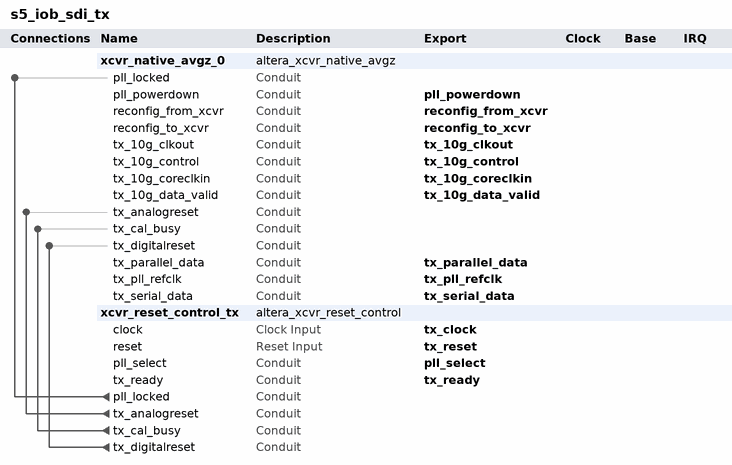
[diagram p0: system contents]
# Platform Designer (Qsys) system s5_iob_sdi_tx, Arria V GZ 5AGZME3H2F35C3
# Parameters at their usual value, and those the tool derives, are not listed.
package require -exact qsys 17.0
create_system s5_iob_sdi_tx
set_project_property DEVICE_FAMILY {Arria V GZ}
set_project_property DEVICE 5AGZME3H2F35C3

add_instance xcvr_native_avgz_0 altera_xcvr_native_avgz 17.0
set_instance_parameter_value xcvr_native_avgz_0 bonded_mode non_bonded
set_instance_parameter_value xcvr_native_avgz_0 cdr_reconfig_enable 0
set_instance_parameter_value xcvr_native_avgz_0 cdr_refclk_cnt 1
set_instance_parameter_value xcvr_native_avgz_0 cdr_refclk_select 0
set_instance_parameter_value xcvr_native_avgz_0 channels 1
set_instance_parameter_value xcvr_native_avgz_0 device_family {Arria V GZ}
set_instance_parameter_value xcvr_native_avgz_0 device_speedgrade fastest
set_instance_parameter_value xcvr_native_avgz_0 enable_port_rx_10g_bitslip 0
set_instance_parameter_value xcvr_native_avgz_0 enable_port_rx_10g_blk_lock 0
set_instance_parameter_value xcvr_native_avgz_0 enable_port_rx_10g_blk_sh_err 0
set_instance_parameter_value xcvr_native_avgz_0 enable_port_rx_10g_clk33out 0
set_instance_parameter_value xcvr_native_avgz_0 enable_port_rx_10g_clr_errblk_count 0
set_instance_parameter_value xcvr_native_avgz_0 enable_port_rx_10g_crc32_err 0
set_instance_parameter_value xcvr_native_avgz_0 enable_port_rx_10g_data_valid 0
set_instance_parameter_value xcvr_native_avgz_0 enable_port_rx_10g_descram_err 0
set_instance_parameter_value xcvr_native_avgz_0 enable_port_rx_10g_fifo_align_clr 0
set_instance_parameter_value xcvr_native_avgz_0 enable_port_rx_10g_fifo_align_en 0
set_instance_parameter_value xcvr_native_avgz_0 enable_port_rx_10g_fifo_align_val 0
set_instance_parameter_value xcvr_native_avgz_0 enable_port_rx_10g_fifo_del 0
set_instance_parameter_value xcvr_native_avgz_0 enable_port_rx_10g_fifo_empty 0
set_instance_parameter_value xcvr_native_avgz_0 enable_port_rx_10g_fifo_full 0
set_instance_parameter_value xcvr_native_avgz_0 enable_port_rx_10g_fifo_insert 0
set_instance_parameter_value xcvr_native_avgz_0 enable_port_rx_10g_fifo_pempty 0
set_instance_parameter_value xcvr_native_avgz_0 enable_port_rx_10g_fifo_pfull 0
set_instance_parameter_value xcvr_native_avgz_0 enable_port_rx_10g_fifo_rd_en 0
set_instance_parameter_value xcvr_native_avgz_0 enable_port_rx_10g_frame 0
set_instance_parameter_value xcvr_native_avgz_0 enable_port_rx_10g_frame_diag_err 0
set_instance_parameter_value xcvr_native_avgz_0 enable_port_rx_10g_frame_diag_status 0
set_instance_parameter_value xcvr_native_avgz_0 enable_port_rx_10g_frame_lock 0
set_instance_parameter_value xcvr_native_avgz_0 enable_port_rx_10g_frame_mfrm_err 0
set_instance_parameter_value xcvr_native_avgz_0 enable_port_rx_10g_frame_pyld_ins 0
set_instance_parameter_value xcvr_native_avgz_0 enable_port_rx_10g_frame_skip_err 0
set_instance_parameter_value xcvr_native_avgz_0 enable_port_rx_10g_frame_skip_ins 0
set_instance_parameter_value xcvr_native_avgz_0 enable_port_rx_10g_frame_sync_err 0
set_instance_parameter_value xcvr_native_avgz_0 enable_port_rx_10g_highber 0
set_instance_parameter_value xcvr_native_avgz_0 enable_port_rx_10g_highber_clr_cnt 0
set_instance_parameter_value xcvr_native_avgz_0 enable_port_rx_is_lockedtodata 1
set_instance_parameter_value xcvr_native_avgz_0 enable_port_rx_is_lockedtoref 0
set_instance_parameter_value xcvr_native_avgz_0 enable_port_rx_pma_clkout 1
set_instance_parameter_value xcvr_native_avgz_0 enable_port_rx_pma_pclk 0
set_instance_parameter_value xcvr_native_avgz_0 enable_port_rx_pma_qpipulldn 0
set_instance_parameter_value xcvr_native_avgz_0 enable_port_rx_seriallpbken 1
set_instance_parameter_value xcvr_native_avgz_0 enable_port_rx_signaldetect 0
set_instance_parameter_value xcvr_native_avgz_0 enable_port_rx_std_bitrev_ena 0
set_instance_parameter_value xcvr_native_avgz_0 enable_port_rx_std_bitslip 0
set_instance_parameter_value xcvr_native_avgz_0 enable_port_rx_std_bitslipboundarysel 0
set_instance_parameter_value xcvr_native_avgz_0 enable_port_rx_std_byteorder_ena 0
set_instance_parameter_value xcvr_native_avgz_0 enable_port_rx_std_byteorder_flag 0
set_instance_parameter_value xcvr_native_avgz_0 enable_port_rx_std_byterev_ena 0
set_instance_parameter_value xcvr_native_avgz_0 enable_port_rx_std_pcfifo_empty 0
set_instance_parameter_value xcvr_native_avgz_0 enable_port_rx_std_pcfifo_full 0
set_instance_parameter_value xcvr_native_avgz_0 enable_port_rx_std_polinv 0
set_instance_parameter_value xcvr_native_avgz_0 enable_port_rx_std_prbs_status 0
set_instance_parameter_value xcvr_native_avgz_0 enable_port_rx_std_rmfifo_empty 0
set_instance_parameter_value xcvr_native_avgz_0 enable_port_rx_std_rmfifo_full 0
set_instance_parameter_value xcvr_native_avgz_0 enable_port_rx_std_runlength_err 0
set_instance_parameter_value xcvr_native_avgz_0 enable_port_rx_std_signaldetect 0
set_instance_parameter_value xcvr_native_avgz_0 enable_port_rx_std_wa_a1a2size 0
set_instance_parameter_value xcvr_native_avgz_0 enable_port_rx_std_wa_patternalign 0
set_instance_parameter_value xcvr_native_avgz_0 enable_port_rx_teng_prbs_status 1
set_instance_parameter_value xcvr_native_avgz_0 enable_port_tx_10g_bitslip 0
set_instance_parameter_value xcvr_native_avgz_0 enable_port_tx_10g_fifo_del 0
set_instance_parameter_value xcvr_native_avgz_0 enable_port_tx_10g_fifo_empty 0
set_instance_parameter_value xcvr_native_avgz_0 enable_port_tx_10g_fifo_full 0
set_instance_parameter_value xcvr_native_avgz_0 enable_port_tx_10g_fifo_insert 0
set_instance_parameter_value xcvr_native_avgz_0 enable_port_tx_10g_fifo_pempty 0
set_instance_parameter_value xcvr_native_avgz_0 enable_port_tx_10g_fifo_pfull 0
set_instance_parameter_value xcvr_native_avgz_0 enable_port_tx_10g_frame 0
set_instance_parameter_value xcvr_native_avgz_0 enable_port_tx_10g_frame_burst_en 0
set_instance_parameter_value xcvr_native_avgz_0 enable_port_tx_10g_frame_diag_status 0
set_instance_parameter_value xcvr_native_avgz_0 enable_port_tx_pma_pclk 0
set_instance_parameter_value xcvr_native_avgz_0 enable_port_tx_pma_qpipulldn 0
set_instance_parameter_value xcvr_native_avgz_0 enable_port_tx_pma_qpipullup 0
set_instance_parameter_value xcvr_native_avgz_0 enable_port_tx_pma_rxfound 0
set_instance_parameter_value xcvr_native_avgz_0 enable_port_tx_pma_txdetectrx 0
set_instance_parameter_value xcvr_native_avgz_0 enable_port_tx_std_bitslipboundarysel 0
set_instance_parameter_value xcvr_native_avgz_0 enable_port_tx_std_elecidle 0
set_instance_parameter_value xcvr_native_avgz_0 enable_port_tx_std_pcfifo_empty 0
set_instance_parameter_value xcvr_native_avgz_0 enable_port_tx_std_pcfifo_full 0
set_instance_parameter_value xcvr_native_avgz_0 enable_port_tx_std_polinv 0
set_instance_parameter_value xcvr_native_avgz_0 enable_ports_rx_manual_cdr_mode 0
set_instance_parameter_value xcvr_native_avgz_0 enable_simple_interface 0
set_instance_parameter_value xcvr_native_avgz_0 enable_std 0
set_instance_parameter_value xcvr_native_avgz_0 enable_teng 1
set_instance_parameter_value xcvr_native_avgz_0 gui_pll_reconfig_pll0_clk_network x1
set_instance_parameter_value xcvr_native_avgz_0 gui_pll_reconfig_pll0_data_rate {1250 Mbps}
set_instance_parameter_value xcvr_native_avgz_0 gui_pll_reconfig_pll0_pll_type ATX
set_instance_parameter_value xcvr_native_avgz_0 gui_pll_reconfig_pll0_refclk_freq {148.5 MHz}
set_instance_parameter_value xcvr_native_avgz_0 gui_pll_reconfig_pll0_refclk_sel 0
set_instance_parameter_value xcvr_native_avgz_0 gui_pll_reconfig_pll1_clk_network x1
set_instance_parameter_value xcvr_native_avgz_0 gui_pll_reconfig_pll1_data_rate {1250 Mbps}
set_instance_parameter_value xcvr_native_avgz_0 gui_pll_reconfig_pll1_pll_type CMU
set_instance_parameter_value xcvr_native_avgz_0 gui_pll_reconfig_pll1_refclk_freq {125.0 MHz}
set_instance_parameter_value xcvr_native_avgz_0 gui_pll_reconfig_pll1_refclk_sel 0
set_instance_parameter_value xcvr_native_avgz_0 gui_pll_reconfig_pll2_clk_network x1
set_instance_parameter_value xcvr_native_avgz_0 gui_pll_reconfig_pll2_data_rate {1250 Mbps}
set_instance_parameter_value xcvr_native_avgz_0 gui_pll_reconfig_pll2_pll_type CMU
set_instance_parameter_value xcvr_native_avgz_0 gui_pll_reconfig_pll2_refclk_freq {125.0 MHz}
set_instance_parameter_value xcvr_native_avgz_0 gui_pll_reconfig_pll2_refclk_sel 0
set_instance_parameter_value xcvr_native_avgz_0 gui_pll_reconfig_pll3_clk_network x1
set_instance_parameter_value xcvr_native_avgz_0 gui_pll_reconfig_pll3_data_rate {1250 Mbps}
set_instance_parameter_value xcvr_native_avgz_0 gui_pll_reconfig_pll3_pll_type CMU
set_instance_parameter_value xcvr_native_avgz_0 gui_pll_reconfig_pll3_refclk_freq {125.0 MHz}
set_instance_parameter_value xcvr_native_avgz_0 gui_pll_reconfig_pll3_refclk_sel 0
set_instance_parameter_value xcvr_native_avgz_0 message_level error
set_instance_parameter_value xcvr_native_avgz_0 pll_external_enable 0
set_instance_parameter_value xcvr_native_avgz_0 pll_reconfig_enable 0
set_instance_parameter_value xcvr_native_avgz_0 pll_refclk_cnt 1
set_instance_parameter_value xcvr_native_avgz_0 pll_select 0
set_instance_parameter_value xcvr_native_avgz_0 plls 1
set_instance_parameter_value xcvr_native_avgz_0 pma_direct_width 40
set_instance_parameter_value xcvr_native_avgz_0 rx_clkslip_enable 1
set_instance_parameter_value xcvr_native_avgz_0 rx_enable 0
set_instance_parameter_value xcvr_native_avgz_0 rx_ppm_detect_threshold 1000
set_instance_parameter_value xcvr_native_avgz_0 set_cdr_refclk_freq {148.5 MHz}
set_instance_parameter_value xcvr_native_avgz_0 set_data_path_select standard
set_instance_parameter_value xcvr_native_avgz_0 set_data_rate 11880
set_instance_parameter_value xcvr_native_avgz_0 show_advanced_features 0
set_instance_parameter_value xcvr_native_avgz_0 std_low_latency_bypass_enable 0
set_instance_parameter_value xcvr_native_avgz_0 std_pcs_pma_width 10
set_instance_parameter_value xcvr_native_avgz_0 std_protocol_hint basic
set_instance_parameter_value xcvr_native_avgz_0 std_rx_8b10b_enable 0
set_instance_parameter_value xcvr_native_avgz_0 std_rx_bitrev_enable 0
set_instance_parameter_value xcvr_native_avgz_0 std_rx_byte_deser_enable 0
set_instance_parameter_value xcvr_native_avgz_0 std_rx_byte_order_enable 0
set_instance_parameter_value xcvr_native_avgz_0 std_rx_byte_order_mode manual
set_instance_parameter_value xcvr_native_avgz_0 std_rx_byte_order_pad 0
set_instance_parameter_value xcvr_native_avgz_0 std_rx_byte_order_pattern 0
set_instance_parameter_value xcvr_native_avgz_0 std_rx_byte_order_symbol_count 1
set_instance_parameter_value xcvr_native_avgz_0 std_rx_byterev_enable 0
set_instance_parameter_value xcvr_native_avgz_0 std_rx_pcfifo_mode low_latency
set_instance_parameter_value xcvr_native_avgz_0 std_rx_polinv_enable 0
set_instance_parameter_value xcvr_native_avgz_0 std_rx_rmfifo_enable 0
set_instance_parameter_value xcvr_native_avgz_0 std_rx_rmfifo_pattern_n 00000
set_instance_parameter_value xcvr_native_avgz_0 std_rx_rmfifo_pattern_p 00000
set_instance_parameter_value xcvr_native_avgz_0 std_rx_run_length_val 31
set_instance_parameter_value xcvr_native_avgz_0 std_rx_word_aligner_mode bit_slip
set_instance_parameter_value xcvr_native_avgz_0 std_rx_word_aligner_pattern 0000000000
set_instance_parameter_value xcvr_native_avgz_0 std_rx_word_aligner_pattern_len 7
set_instance_parameter_value xcvr_native_avgz_0 std_rx_word_aligner_renumber 3
set_instance_parameter_value xcvr_native_avgz_0 std_rx_word_aligner_rgnumber 3
set_instance_parameter_value xcvr_native_avgz_0 std_rx_word_aligner_rknumber 3
set_instance_parameter_value xcvr_native_avgz_0 std_tx_8b10b_disp_ctrl_enable 0
set_instance_parameter_value xcvr_native_avgz_0 std_tx_8b10b_enable 0
set_instance_parameter_value xcvr_native_avgz_0 std_tx_bitrev_enable 0
set_instance_parameter_value xcvr_native_avgz_0 std_tx_bitslip_enable 0
set_instance_parameter_value xcvr_native_avgz_0 std_tx_byte_ser_enable 0
set_instance_parameter_value xcvr_native_avgz_0 std_tx_byterev_enable 0
set_instance_parameter_value xcvr_native_avgz_0 std_tx_pcfifo_mode low_latency
set_instance_parameter_value xcvr_native_avgz_0 std_tx_polinv_enable 0
set_instance_parameter_value xcvr_native_avgz_0 teng_pcs_pma_width 40
set_instance_parameter_value xcvr_native_avgz_0 teng_pld_pcs_width 40
set_instance_parameter_value xcvr_native_avgz_0 teng_protocol_hint basic
set_instance_parameter_value xcvr_native_avgz_0 teng_rx_bitslip_enable 0
set_instance_parameter_value xcvr_native_avgz_0 teng_rx_frmsync_user_length 2048
set_instance_parameter_value xcvr_native_avgz_0 teng_rx_polinv_enable 0
set_instance_parameter_value xcvr_native_avgz_0 teng_rxfifo_align_del 0
set_instance_parameter_value xcvr_native_avgz_0 teng_rxfifo_control_del 0
set_instance_parameter_value xcvr_native_avgz_0 teng_rxfifo_empty 0
set_instance_parameter_value xcvr_native_avgz_0 teng_rxfifo_full 31
set_instance_parameter_value xcvr_native_avgz_0 teng_rxfifo_mode phase_comp
set_instance_parameter_value xcvr_native_avgz_0 teng_rxfifo_pempty 2
set_instance_parameter_value xcvr_native_avgz_0 teng_rxfifo_pfull 23
set_instance_parameter_value xcvr_native_avgz_0 teng_tx_bitslip_enable 0
set_instance_parameter_value xcvr_native_avgz_0 teng_tx_frmgen_burst_enable 0
set_instance_parameter_value xcvr_native_avgz_0 teng_tx_frmgen_user_length 2048
set_instance_parameter_value xcvr_native_avgz_0 teng_tx_polinv_enable 0
set_instance_parameter_value xcvr_native_avgz_0 teng_tx_scram_user_seed 000000000000000
set_instance_parameter_value xcvr_native_avgz_0 teng_tx_sh_err 0
set_instance_parameter_value xcvr_native_avgz_0 teng_txfifo_empty 0
set_instance_parameter_value xcvr_native_avgz_0 teng_txfifo_full 31
set_instance_parameter_value xcvr_native_avgz_0 teng_txfifo_mode phase_comp
set_instance_parameter_value xcvr_native_avgz_0 teng_txfifo_pempty 2
set_instance_parameter_value xcvr_native_avgz_0 teng_txfifo_pfull 23
set_instance_parameter_value xcvr_native_avgz_0 tx_enable 1
set_instance_parameter_value xcvr_native_avgz_0 tx_pma_clk_div 1

add_instance xcvr_reset_control_tx altera_xcvr_reset_control 17.0
set_instance_parameter_value xcvr_reset_control_tx CHANNELS 1
set_instance_parameter_value xcvr_reset_control_tx RX_ENABLE 0
set_instance_parameter_value xcvr_reset_control_tx RX_PER_CHANNEL 0
set_instance_parameter_value xcvr_reset_control_tx SYS_CLK_IN_MHZ 125
set_instance_parameter_value xcvr_reset_control_tx TX_PLL_ENABLE 0
set_instance_parameter_value xcvr_reset_control_tx T_RX_ANALOGRESET 40
set_instance_parameter_value xcvr_reset_control_tx T_TX_ANALOGRESET 0
set_instance_parameter_value xcvr_reset_control_tx T_TX_DIGITALRESET 20
set_instance_parameter_value xcvr_reset_control_tx device_family {Arria V GZ}
set_instance_parameter_value xcvr_reset_control_tx gui_pll_cal_busy 0

# connections
add_connection xcvr_reset_control_tx.pll_locked xcvr_native_avgz_0.pll_locked conduit
add_connection xcvr_reset_control_tx.tx_analogreset xcvr_native_avgz_0.tx_analogreset conduit
add_connection xcvr_reset_control_tx.tx_cal_busy xcvr_native_avgz_0.tx_cal_busy conduit
add_connection xcvr_reset_control_tx.tx_digitalreset xcvr_native_avgz_0.tx_digitalreset conduit

# exported interfaces
add_interface pll_powerdown conduit end
set_interface_property pll_powerdown EXPORT_OF xcvr_native_avgz_0.pll_powerdown
add_interface pll_select conduit end
set_interface_property pll_select EXPORT_OF xcvr_reset_control_tx.pll_select
add_interface reconfig_from_xcvr conduit end
set_interface_property reconfig_from_xcvr EXPORT_OF xcvr_native_avgz_0.reconfig_from_xcvr
add_interface reconfig_to_xcvr conduit end
set_interface_property reconfig_to_xcvr EXPORT_OF xcvr_native_avgz_0.reconfig_to_xcvr
add_interface tx_10g_clkout conduit end
set_interface_property tx_10g_clkout EXPORT_OF xcvr_native_avgz_0.tx_10g_clkout
add_interface tx_10g_control conduit end
set_interface_property tx_10g_control EXPORT_OF xcvr_native_avgz_0.tx_10g_control
add_interface tx_10g_coreclkin conduit end
set_interface_property tx_10g_coreclkin EXPORT_OF xcvr_native_avgz_0.tx_10g_coreclkin
add_interface tx_10g_data_valid conduit end
set_interface_property tx_10g_data_valid EXPORT_OF xcvr_native_avgz_0.tx_10g_data_valid
add_interface tx_clock clock sink
set_interface_property tx_clock EXPORT_OF xcvr_reset_control_tx.clock
add_interface tx_parallel_data conduit end
set_interface_property tx_parallel_data EXPORT_OF xcvr_native_avgz_0.tx_parallel_data
add_interface tx_pll_refclk conduit end
set_interface_property tx_pll_refclk EXPORT_OF xcvr_native_avgz_0.tx_pll_refclk
add_interface tx_ready conduit end
set_interface_property tx_ready EXPORT_OF xcvr_reset_control_tx.tx_ready
add_interface tx_reset reset sink
set_interface_property tx_reset EXPORT_OF xcvr_reset_control_tx.reset
add_interface tx_serial_data conduit end
set_interface_property tx_serial_data EXPORT_OF xcvr_native_avgz_0.tx_serial_data

set_interconnect_requirement {$system} qsys_mm.clockCrossingAdapter HANDSHAKE
set_interconnect_requirement {$system} qsys_mm.enableEccProtection FALSE
set_interconnect_requirement {$system} qsys_mm.insertDefaultSlave FALSE
set_interconnect_requirement {$system} qsys_mm.maxAdditionalLatency 1

save_system s5_iob_sdi_tx.qsys
